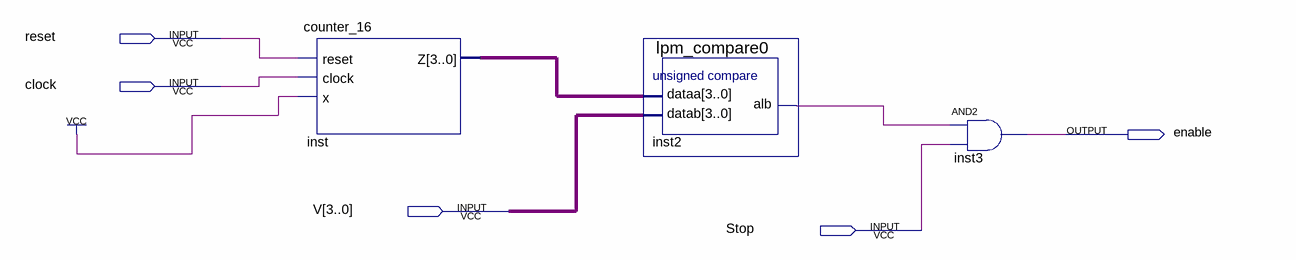
[diagram p0: schematic sheet]
// Quartus schematic velocimetro.bdf as structural Verilog: 3 symbols, 5 pins
module velocimetro (
  input  reset,
  input  clock,
  input  [3:0] V,
  input  Stop,
  output enable
);

  wire inst2_alb;
  wire [3:0] inst_z;

  counter_16 inst (.reset(reset), .clock(clock), .x(1'b1), .Z(inst_z));
  lpm_compare0 inst2 (.dataa(inst_z), .datab(V), .alb(inst2_alb));
  and inst3 (enable, inst2_alb, Stop);
endmodule
